# Altium project HYDRA_V3_POWER.PrjPcb (part 2 of 2)

## Sheet RP_AND_SAFETYSW.SchDoc
size B; SheetNumber: 6; SheetTotal: 9
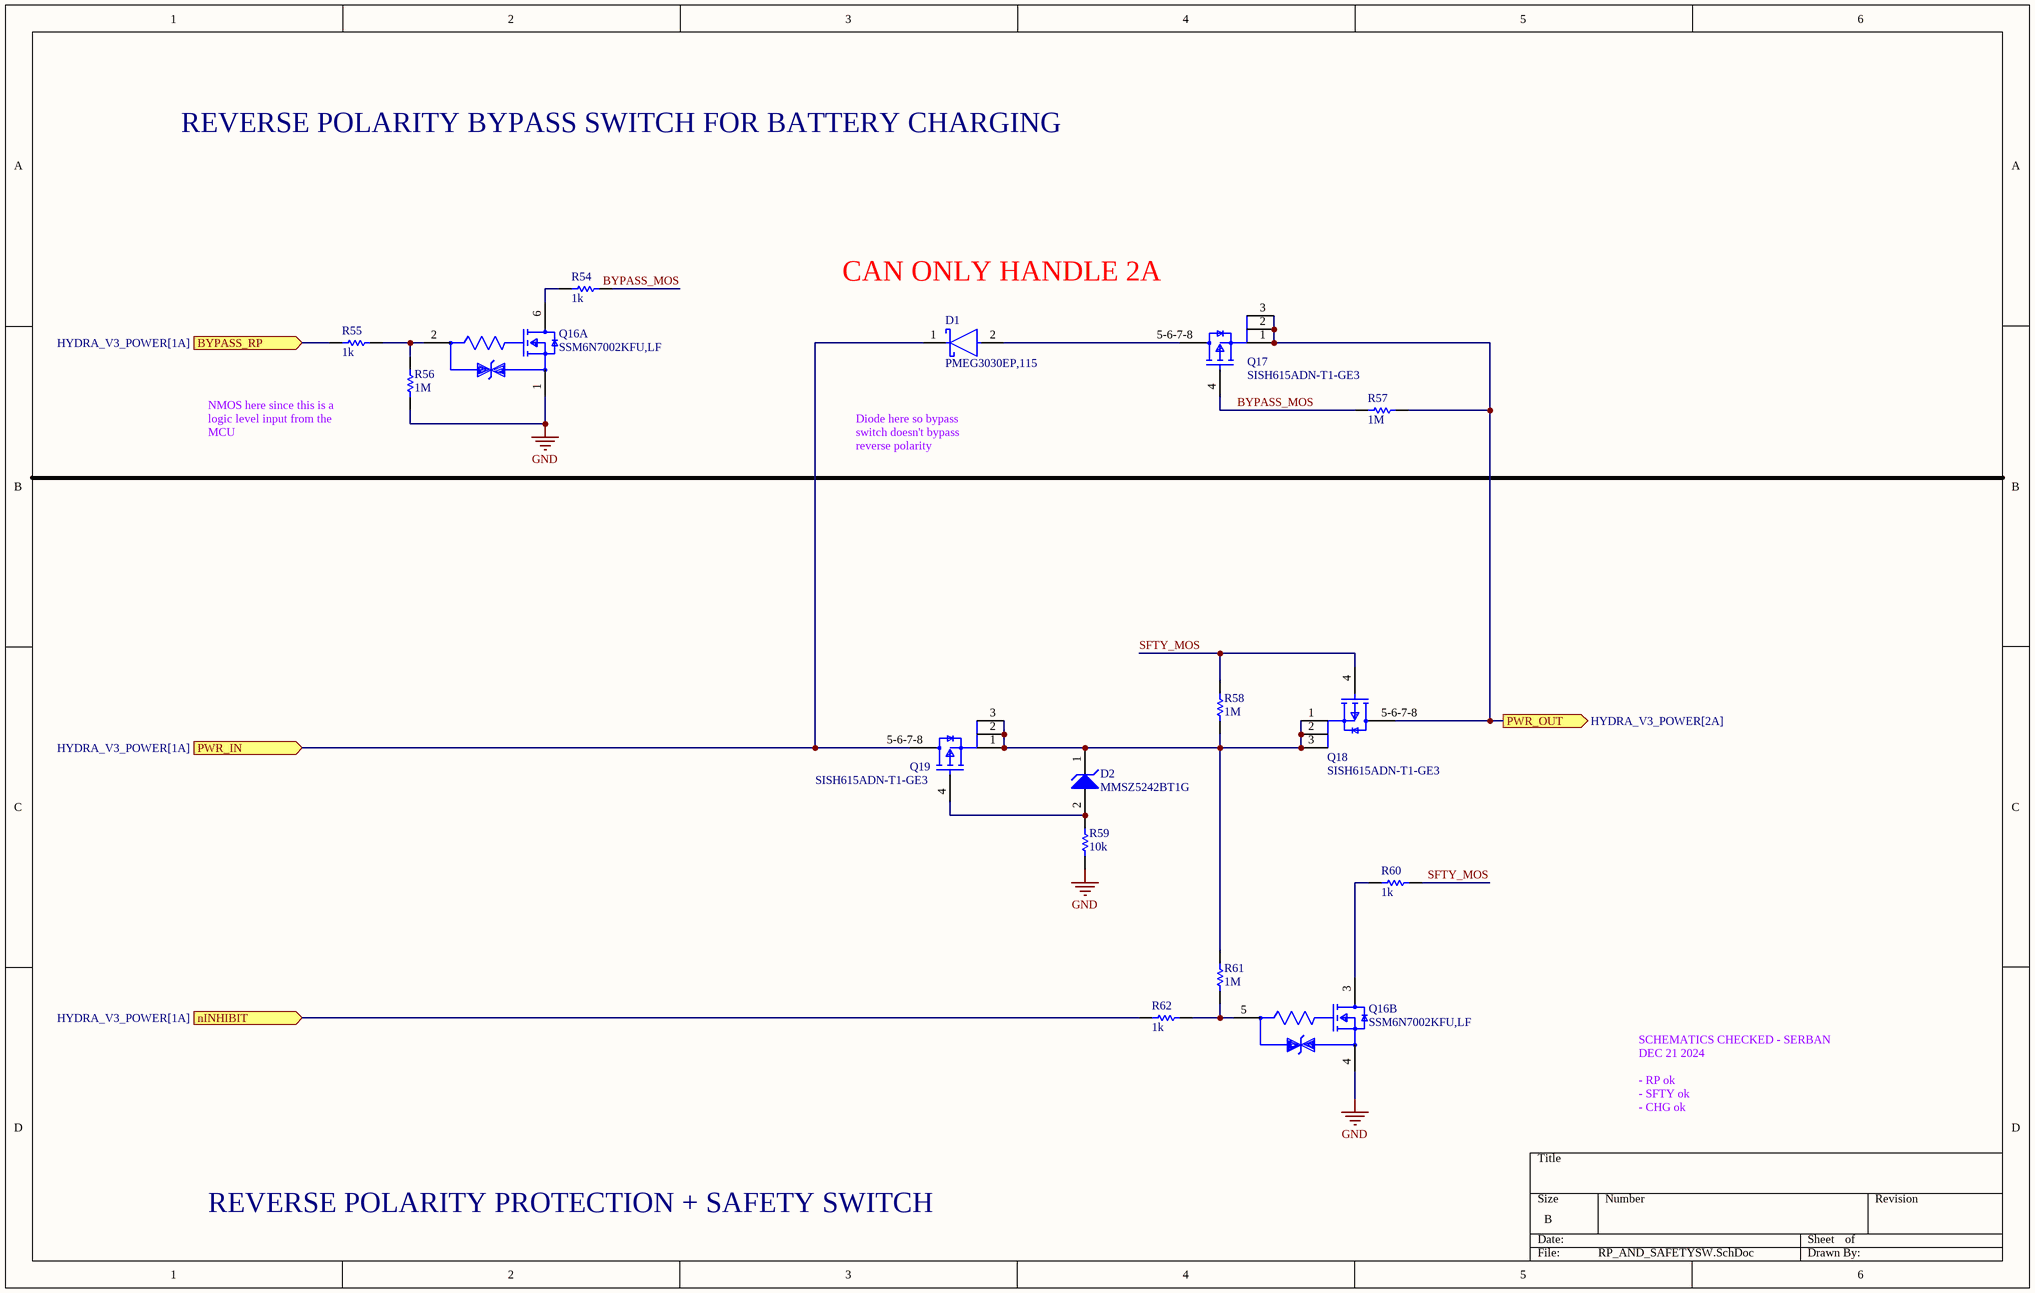
[diagram p11: RP_AND_SAFETYSW.SchDoc]

### Parts
D1  PMEG3030EP,115  [FP-SOD128-MFG]
D2  MMSZ5242BT1G  [ONSC-SOD-123-2-425-04_V]
Q16  SSM6N7002KFU,LF  [FP-SSOP6-P-0_65A-MFG]  (parts A,B of 2)
Q17  SISH615ADN-T1-GE3  [SISH615ADN-T1-GE3-Footprint-1]
Q18  SISH615ADN-T1-GE3  [SISH615ADN-T1-GE3-Footprint-1]
Q19  SISH615ADN-T1-GE3  [SISH615ADN-T1-GE3-Footprint-1]
R54  1k  [R0603B]
R55  1k  [R0603B]
R56  1M  [R0603B]
R57  1M  [R0603B]
R58  1M  [R0603B]
R59  10k  [R0603B]
R60  1k  [R0603B]
R61  1M  [R0603B]
R62  1k  [R0603B]

### Ports
BYPASS_RP (in, see HYDRA_V3_POWER[1A]), nINHIBIT (in, see HYDRA_V3_POWER[1A]), PWR_IN (in, see HYDRA_V3_POWER[1A]), PWR_OUT (out, see HYDRA_V3_POWER[2A])

### Nets
GND: Q16.1(Source1) Q16.4(Source2) R56.1 R59.1
BYPASS_MOS: Q17.4(G) R54.1 R57.2
nINHIBIT: R62.2 ; port nINHIBIT
PWR_IN: Q17.1(S) Q17.2(S) Q17.3(S) Q18.5-6-7-8(D) R57.1 ; port PWR_OUT
RP_CHRG_ENABLE: R55.2 ; port BYPASS_RP
SFTY_MOS: Q18.4(G) R58.2 R60.1
NetD1_1: D1.1(C) Q19.5-6-7-8(D) ; port PWR_IN
NetD1_2: D1.2(A) Q17.5-6-7-8(D)
NetD2_1: D2.1(K) Q18.1(S) Q18.2(S) Q18.3(S) Q19.1(S) Q19.2(S) Q19.3(S) R58.1 R61.1
NetD2_2: D2.2(A) Q19.4(G) R59.2
NetQ16_2: Q16.2(Gate1) R55.1 R56.2
NetQ16_3: Q16.3(Drain2) R60.2
NetQ16_5: Q16.5(Gate2) R61.2 R62.1
NetQ16_6: Q16.6(Drain1) R54.2

### Notes on the sheet
- REVERSE POLARITY BYPASS SWITCH FOR BATTERY CHARGING
- CAN ONLY HANDLE 2A
- NMOS here since this is a logic level input from the MCU
- Diode here so bypass switch doesn't bypass reverse polarity
- SCHEMATICS CHECKED - SERBAN
  DEC 21 2024
  - RP ok
  - SFTY ok
  - CHG ok
- REVERSE POLARITY PROTECTION + SAFETY SWITCH

### Library data of the parts
D1 = CMP-14398-000052-1: DIODE SCHOTTKY 30V 3A SOD128; RoHS Compliant: Yes
D2 = CMP-1060-00565-1: Zener Voltage Regulator, 500 mW, 2-Pin SOD-123, Pb-Free, Tape and Reel; Manufacturer: On Semiconductor; P Max (W): 0.5; VZ Typ (V): 12; PartNumber: MMSZ5242BT1G; PackageReference: SOD-123-2-425-04; ComponentLink3URL: http://www.onsemi.com/pub_link/Collateral/425-04.PDF; Mounting Technology: Surface Mount; ComponentLink2Description: Datasheet; ComponentLink1URL: http://www.onsemi.com/; ComponentLink3Description: Package Specification; PackageDescription: 2-Pin SOD, Body 1.6 x 2.69 mm; PackageVersion: Rev. G, 10/2009; ComponentLink1Description: Manufacturer URL; RoHS: Pb-Free; ComponentLink2URL: http://www.onsemi.com/pub_link/Collateral/MMSZ5221BT1-D.PDF; Packing: Tape and Reel; DatasheetVersion: Rev. 12
Q16 = CMP-35916-000009-1: MOSFET 2N-CH 60V 0.3A; Input Capacitance: 40pF; Continuous Drain Current (ID): 300mA; Max Power Dissipation: 285mW; FET Type: 2 N-Channel; Rds On Max: 1.5R; Mount: Surface Mount; Drain to Source Voltage (Vdss): 60V; Packaging: Tape and Reel
Q17-Q19 = CMP-013-00018-2: Trans MOSFET P-CH 20V 22.1A 8-Pin PowerPAK 1212 EP T/R; Source: SISH615ADN-T1-GE3.SchLib; Design Item ID: CMP-013-00036-4; Component Type: Standard; Pins: 5
R54-R62 = CMP-009-00002-14: Resistor

## Sheet LM7310.SchDoc
size A; SheetNumber: 9; SheetTotal: 9
Used 3 times, as channels LS_0, LS_1, LS_2. Parts and nets are listed once, with the designators drawn on the sheet.
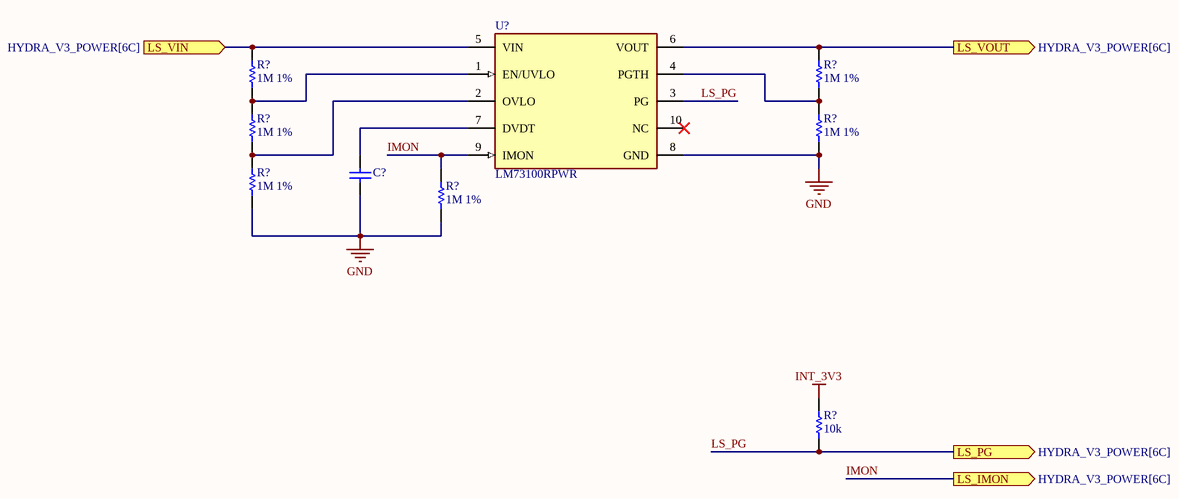
[diagram p12: LM7310.SchDoc]

### Parts
(Parts that share a designator on the sheet are numbered #1, #2 ... from top to bottom, then left to right.)
C?  CAP 3.3nF 50V 0402(1005)  [CAPC0402(1005)60_L]  (value not drawn)
R?#1  1M 1%  [R0603B]
R?#2  1M 1%  [R0603B]
R?#3  1M 1%  [R0603B]
R?#4  1M 1%  [R0603B]
R?#5  1M 1%  [R0603B]
R?#6  1M 1%  [R0603B]
R?#7  10k  [R0603B]
U?  LM73100RPWR  [FP-RPW0010A-MFG]

### Ports
LS_IMON (out, see HYDRA_V3_POWER[6C]), LS_PG (out, see HYDRA_V3_POWER[6C]), LS_VIN (in, see HYDRA_V3_POWER[6C]), LS_VOUT (out, see HYDRA_V3_POWER[6C])

### Nets
GND: C?.1 R?#4.1 R?#5.1 R?#6.1 U?.8(GND)
INT_3V3: R?#7.2
IMON: R?#6.2 U?.9(IMON) ; port LS_IMON
LS_PG: R?#7.1 U?.3(PG) ; port LS_PG
LS_VIN: R?#1.2 U?.5(VIN) ; port LS_VIN
LS_VOUT: R?#2.2 U?.6(VOUT) ; port LS_VOUT
NetC?_2: C?.2 U?.7(DVDT)
NetR?#1_1: R?#1.1 R?#3.2 U?.1(EN/UVLO)
NetR?#2_1: R?#2.1 R?#4.2 U?.4(PGTH)
NetR?#3_1: R?#3.1 R?#5.2 U?.2(OVLO)

Not connected (* = marked no-connect by the designer): U? 10(NC)*

### Channels
LS_0: designators C?=C?_LS_0 R?=R?_LS_0#1 R?=R?_LS_0#3 R?=R?_LS_0#5 R?=R?_LS_0#6 R?=R?_LS_0#7 R?=R?_LS_0#2 R?=R?_LS_0#4 U?=U?_LS_0; ports LS_IMON=HYDRA_VCC_IMON LS_PG=HYDRA_VCC_PG LS_VIN=M3_PWR LS_VOUT=HYDRA_VCC
LS_1: designators C?=C?_LS_1 R?=R?_LS_1#1 R?=R?_LS_1#3 R?=R?_LS_1#5 R?=R?_LS_1#6 R?=R?_LS_1#7 R?=R?_LS_1#2 R?=R?_LS_1#4 U?=U?_LS_1; ports LS_IMON=HYDRA_5V_IMON LS_PG=HYDRA_5V_PG LS_VIN=NetC14_1 LS_VOUT=HYDRA_5V
LS_2: designators C?=C?_LS_2 R?=R?_LS_2#1 R?=R?_LS_2#3 R?=R?_LS_2#5 R?=R?_LS_2#6 R?=R?_LS_2#7 R?=R?_LS_2#2 R?=R?_LS_2#4 U?=U?_LS_2; ports LS_IMON=HYDRA_3V3_IMON LS_PG=HYDRA_3V3_PG LS_VIN=NetC19#2_1 LS_VOUT=HYDRA_3V3

### Library data of the parts
C? = CMP-1034-01778-1: CAP 3.3nF 50V ±5% 0402 (1005 Metric) Thickness 0.6mm SMD; Case-Metric: 1005; Case-EIA: 0402; Tolerance: Â±5%; Max Thickness: 0.6 mm; Technology: SMT; Value: 3.3nF; Rated Voltage: 50 V
R?#1-R?#7 = CMP-009-00002-14: Resistor
U? = CMP-04910-000122-1: 2.7-V TO 23-V, 5.5-A IDEAL DIODE; RoHS Compliant: Yes

## Nets that join several sheets
GND: HYDRA_V3_POWER (41 pins), STM32G473CET6_PINOUT (39 pins), PWR_PROT (14 pins), CELL_SENSE (7 pins), MOSFET_JUNCTION (22 pins), INT_REG (5 pins), HYDRA_REGULATORS (28 pins), RP_AND_SAFETYSW (Q16.1 Q16.4 R56.1 R59.1), LS_0 (5 pins), LS_1 (5 pins), LS_2 (5 pins)
HYDRA_3V3: HYDRA_V3_POWER (8 pins), LS_2 (R?_LS_2#2.2 U?_LS_2.6)
HYDRA_5V: HYDRA_V3_POWER (8 pins), LS_1 (R?_LS_1#2.2 U?_LS_1.6)
HYDRA_VCC: HYDRA_V3_POWER (J1.01 J1.02 J4.01 J4.02), LS_0 (R?_LS_0#2.2 U?_LS_0.6)
INT_3V3: STM32G473CET6_PINOUT (C29.1 C32.1 U10.3 U11.5), PWR_PROT (C4.1 R31.2 U4.12), MOSFET_JUNCTION (6 pins), INT_REG (C7.1 R38#1.2 U5.2), LS_0 (R?_LS_0#7.2), LS_1 (R?_LS_1#7.2), LS_2 (R?_LS_2#7.2)
INT_PWR: STM32G473CET6_PINOUT (7 pins), CELL_SENSE (C18#1.1 U8#1.2), MOSFET_JUNCTION (Q3.5-6-7-8), INT_REG (C6.1 R40#1.2 U5.1)
CAN_INH: STM32G473CET6_PINOUT (U11.7), MOSFET_JUNCTION (R21.2)
CELL_0_IN: HYDRA_V3_POWER (P1.1), CELL_SENSE (R69.2 R75.2)
CELL_1_IN: HYDRA_V3_POWER (P1.2), CELL_SENSE (R66.2 R79.2)
CELL_2_IN: HYDRA_V3_POWER (P1.3), CELL_SENSE (R70.2 R80.2)
CELL_3_IN: HYDRA_V3_POWER (P1.4), CELL_SENSE (R76.2)
EMAG_OUT: HYDRA_V3_POWER (P1.5 P1.6), STM32G473CET6_PINOUT (F2.2)
M1_PWR: PWR_PROT (U4.3 U4.4), MOSFET_JUNCTION (Q5.5-6-7-8)
M2_PWR: HYDRA_V3_POWER (16 pins), MOSFET_JUNCTION (U1.3 U1.4)
M3_PWR: MOSFET_JUNCTION (U2.3 U2.4), HYDRA_REGULATORS (12 pins), LS_0 (R?_LS_0#1.2 U?_LS_0.5)
NetC14_1: HYDRA_REGULATORS (7 pins), LS_1 (R?_LS_1#1.2 U?_LS_1.5)
NetC19#2_1: HYDRA_REGULATORS (7 pins), LS_2 (R?_LS_2#1.2 U?_LS_2.5)
NetD1_1: HYDRA_V3_POWER (F1.2), RP_AND_SAFETYSW (D1.1 Q19.5-6-7-8)
nINHIBIT: HYDRA_V3_POWER (P1.7), RP_AND_SAFETYSW (R62.2)
PWR_IN: PWR_PROT (5 pins), RP_AND_SAFETYSW (5 pins)